# Altium project USB-Audio.PrjPcb
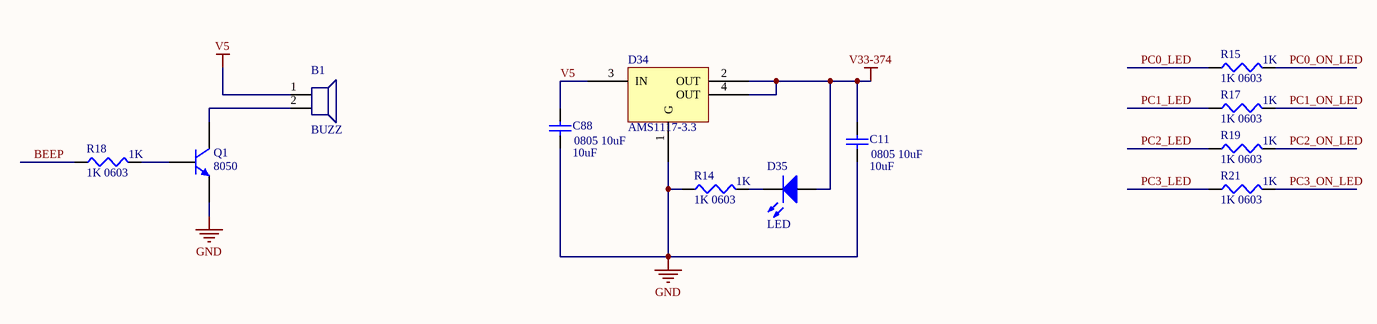
[diagram p0: CH9374.SchDoc]
8 sheets, 292 parts. Net scope: global (net labels, ports and power ports of the same name join across sheets).
Sheets:
  CH9374.SchDoc
  GL852-0.SchDoc
  GL852-1.SchDoc
  GL852-2.SchDoc
  GL852-3.SchDoc
  USB-Switch.SchDoc
  Audio.SchDoc
  CH374.SchDoc

## Sheet CH9374.SchDoc
size A4

### Parts
B1  BUZZ  [BUZZ]
C11  0805 10uF  value 10uF  [C0805]
C88  0805 10uF  value 10uF  [C0805]
D34  AMS1117-3.3  [SOT-223]
D35  LED  [LED0603]
Q1  8050  [TO-226-AA]
R14  1K 0603  value 1K  [R0603]
R15  1K 0603  value 1K  [R0603]
R17  1K 0603  value 1K  [R0603]
R18  1K 0603  value 1K  [R0603]
R19  1K 0603  value 1K  [R0603]
R21  1K 0603  value 1K  [R0603]

### Nets
GND: C11.1 C88.1 D34.1(G) Q1.3(E) R14.1
V5: B1.1(VCC) C88.2 D34.3(IN)
V33-374: C11.2 D34.2(OUT) D34.4(OUT) D35.1(A)
BEEP: R18.1
PC0_LED: R15.1
PC0_ON_LED: R15.2
PC1_LED: R17.1
PC1_ON_LED: R17.2
PC2_LED: R19.1
PC2_ON_LED: R19.2
PC3_LED: R21.1
PC3_ON_LED: R21.2
NetB1_2: B1.2(GND) Q1.1(C)
NetD35_2: D35.2(K) R14.2
NetQ1_2: Q1.2(B) R18.2

### Library data of the parts
C11 C88 = Cap Semi: Capacitor (Semiconductor SIM Model); Published: 8-Jun-2000; LatestRevisionDate: 29-May-2009; LatestRevisionNote: IPC-7351 Footprint Added.; PackageReference: C1206; Publisher: Altium Limited; PackageDescription: Chip Capacitor
Q1 = NPN: NPN Bipolar Transistor; Published: 8-Jun-2000; LatestRevisionDate: 17-Jul-2002; LatestRevisionNote: Re-released for DXP Platform.; PackageReference: TO-226-AA; Publisher: Altium Limited; PackageDescription: TO, Flat Index; 3 In-Line, Axial Leads; Body Dia. 4.8mm; Leads 0.55 x 0.51 mm (max); Code_JEDEC: TO-226-AA
R14 R15 R17-R19 R21 = Res3: Resistor; Published: 8-Jun-2000; LatestRevisionDate: 29-May-2009; LatestRevisionNote: IPC-7351 Footprint Added.; Publisher: Altium Limited; PackageDescription: Chip Resistor
  R14 R15: PackageReference: J1-0603
  R17-R19 R21: PackageReference: R0603

## Sheet GL852-0.SchDoc
size A4
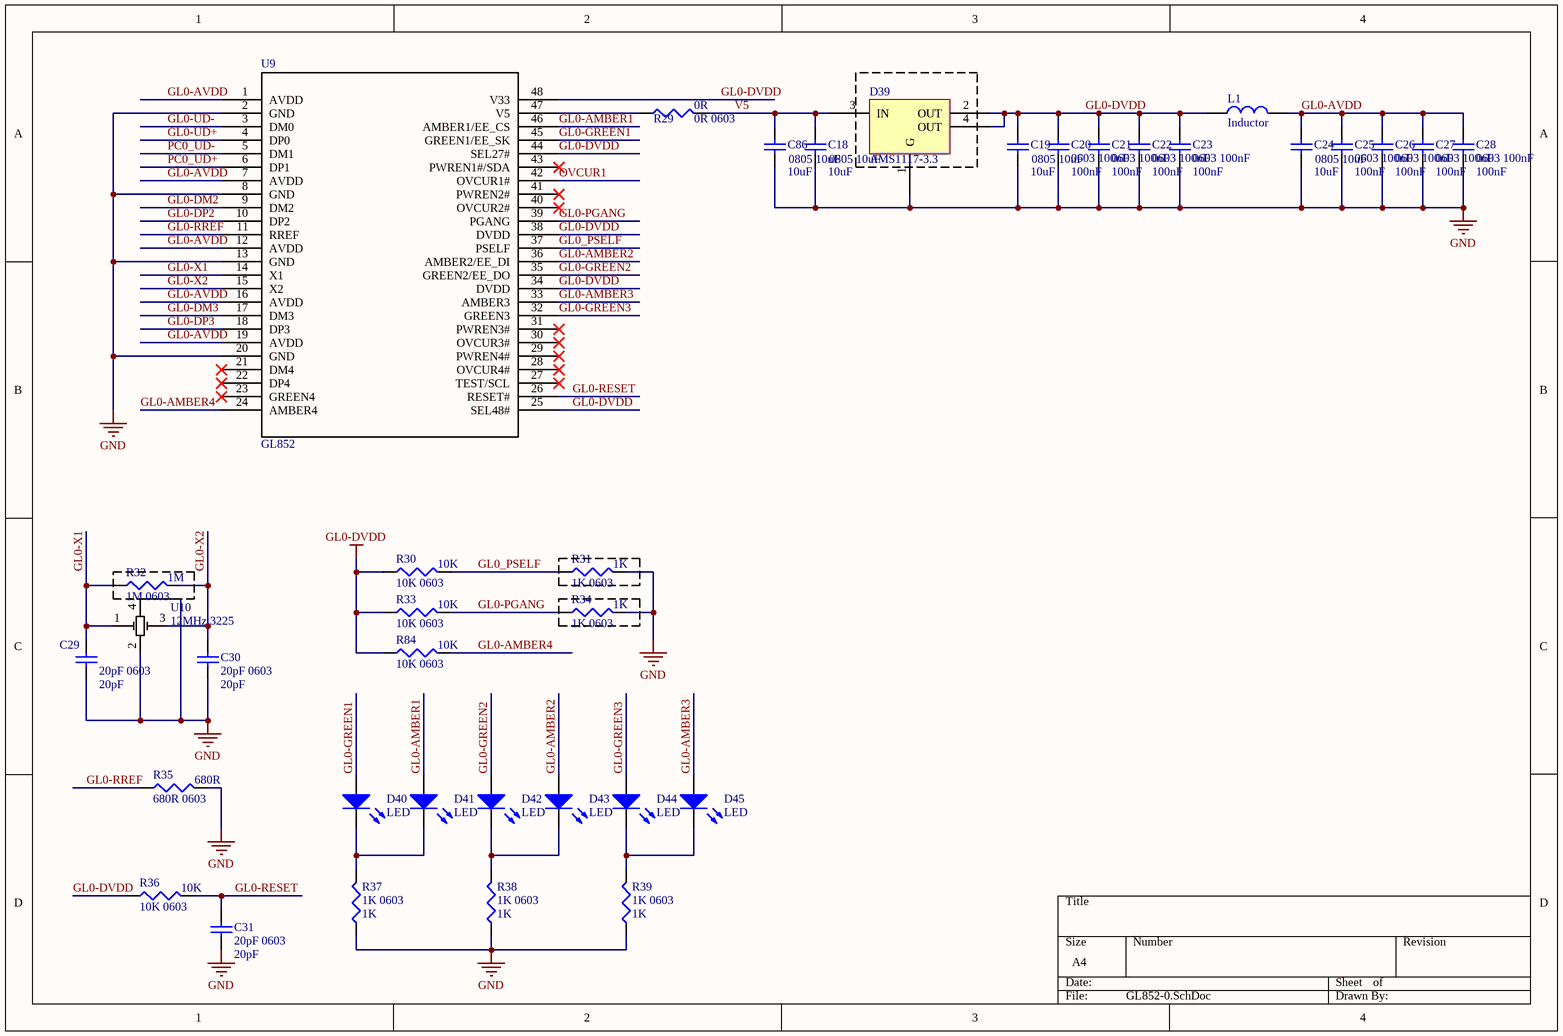
[diagram p1: GL852-0.SchDoc]

### Parts
C18  0805 10uF  value 10uF  [C0805]
C19  0805 10uF  value 10uF  [C0805]
C20  0603 100nF  value 100nF  [C0603]
C21  0603 100nF  value 100nF  [C0603]
C22  0603 100nF  value 100nF  [C0603]
C23  0603 100nF  value 100nF  [C0603]
C24  0805 10uF  value 10uF  [C0805]
C25  0603 100nF  value 100nF  [C0603]
C26  0603 100nF  value 100nF  [C0603]
C27  0603 100nF  value 100nF  [C0603]
C28  0603 100nF  value 100nF  [C0603]
C29  20pF 0603  value 20pF  [C0603]
C30  20pF 0603  value 20pF  [C0603]
C31  20pF 0603  value 20pF  [C0603]
C86  0805 10uF  value 10uF  [C0805]
D39  AMS1117-3.3  [SOT-223]
D40  LED  [LED0603]
D41  LED  [LED0603]
D42  LED  [LED0603]
D43  LED  [LED0603]
D44  LED  [LED0603]
D45  LED  [LED0603]
L1  Inductor  [L0603]
R29  0R 0603  value 0R  [R0603]
R30  10K 0603  value 10K  [R0603]
R31  1K 0603  value 1K  [R0603]
R32  1M 0603  value 1M  [R0603]
R33  10K 0603  value 10K  [R0603]
R34  1K 0603  value 1K  [R0603]
R35  680R 0603  value 680R  [R0603]
R36  10K 0603  value 10K  [R0603]
R37  1K 0603  value 1K  [R0603]
R38  1K 0603  value 1K  [R0603]
R39  1K 0603  value 1K  [R0603]
R84  10K 0603  value 10K  [R0603]
U9  GL852  [qfp48-20-0909b]
U10  12MHz 3225  [XTAL-3225]

### Nets
GL0-DVDD: C19.2 C20.2 C21.2 C22.2 C23.2 D39.2(OUT) D39.4(OUT) L1.1 R30.1 R33.1 R36.1 R84.1 U9.25(SEL48#) U9.34(DVDD) U9.38(DVDD) U9.44(SEL27#) U9.48(V33)
GND: C18.1 C19.1 C20.1 C21.1 C22.1 C23.1 C24.1 C25.1 C26.1 C27.1 C28.1 C29.1 C30.1 C31.1 C86.1 D39.1(G) R31.2 R34.2 R35.2 R37.1 R38.1 R39.1 U9.2(GND) U9.8(GND) U9.13(GND) U9.20(GND) U10.2 U10.4
V5: C18.2 C86.2 D39.3(IN) R29.2
GL0-AMBER1: D41.1(A) U9.46(AMBER1/EE_CS)
GL0-AMBER2: D43.1(A) U9.36(AMBER2/EE_DI)
GL0-AMBER3: D45.1(A) U9.33(AMBER3)
GL0-AMBER4: R84.2 U9.24(AMBER4)
GL0-AVDD: C24.2 C25.2 C26.2 C27.2 C28.2 L1.2 U9.1(AVDD) U9.7(AVDD) U9.12(AVDD) U9.16(AVDD) U9.19(AVDD)
GL0-DM2: U9.9(DM2)
GL0-DM3: U9.17(DM3)
GL0-DP2: U9.10(DP2)
GL0-DP3: U9.18(DP3)
GL0-GREEN1: D40.1(A) U9.45(GREEN1/EE_SK)
GL0-GREEN2: D42.1(A) U9.35(GREEN2/EE_DO)
GL0-GREEN3: D44.1(A) U9.32(GREEN3)
GL0-PGANG: R33.2 R34.1 U9.39(PGANG)
GL0-RESET: C31.2 R36.2 U9.26(RESET#)
GL0-RREF: R35.1 U9.11(RREF)
GL0-UD+: U9.4(DP0)
GL0-UD-: U9.3(DM0)
GL0-X1: C29.2 R32.1 U9.14(X1) U10.1
GL0-X2: C30.2 R32.2 U9.15(X2) U10.3
GL0_PSELF: R30.2 R31.1 U9.37(PSELF)
OVCUR1: U9.42(OVCUR1#)
PC0_UD+: U9.6(DP1)
PC0_UD-: U9.5(DM1)
NetD40_2: D40.2(K) D41.2(K) R37.2
NetD42_2: D42.2(K) D43.2(K) R38.2
NetD44_2: D44.2(K) D45.2(K) R39.2
NetR29_1: R29.1 U9.47(V5)

Not connected (* = marked no-connect by the designer): U9 21(DM4)* 22(DP4)* 23(GREEN4)* 27(TEST/SCL)* 28(OVCUR4#)* 29(PWREN4#)* 30(OVCUR3#)* 31(PWREN3#)* 40(OVCUR2#)* 41(PWREN2#)* 43(PWREN1#/SDA)*

### Library data of the parts
C18-C31 C86 = Cap Semi: Capacitor (Semiconductor SIM Model); Published: 8-Jun-2000; LatestRevisionDate: 29-May-2009; LatestRevisionNote: IPC-7351 Footprint Added.; PackageReference: C1206; Publisher: Altium Limited; PackageDescription: Chip Capacitor
R29-R39 R84 = Res3: Resistor; Published: 8-Jun-2000; LatestRevisionDate: 29-May-2009; LatestRevisionNote: IPC-7351 Footprint Added.; PackageReference: J1-0603; Publisher: Altium Limited; PackageDescription: Chip Resistor
U9 = GL852: Imported; Devide: GL852; RefDes: RefDes; Type: DEV; Value: Value
U10 = Component_1

## Sheet GL852-1.SchDoc
size A4
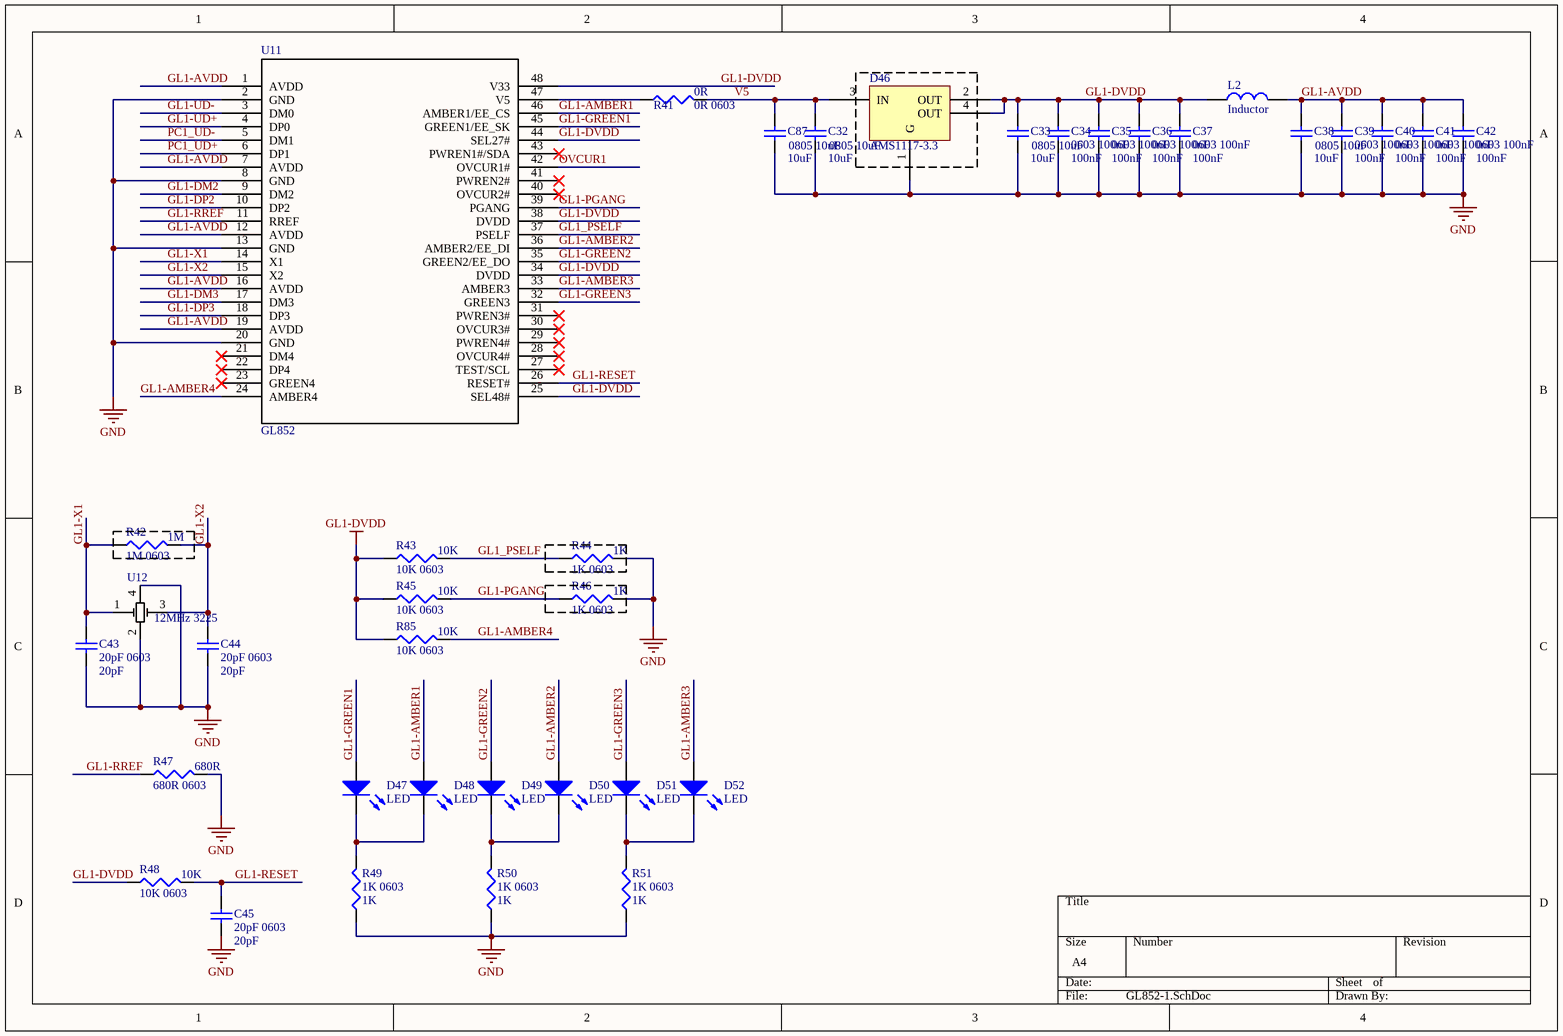
[diagram p2: GL852-1.SchDoc]

### Parts
C32  0805 10uF  value 10uF  [C0805]
C33  0805 10uF  value 10uF  [C0805]
C34  0603 100nF  value 100nF  [C0603]
C35  0603 100nF  value 100nF  [C0603]
C36  0603 100nF  value 100nF  [C0603]
C37  0603 100nF  value 100nF  [C0603]
C38  0805 10uF  value 10uF  [C0805]
C39  0603 100nF  value 100nF  [C0603]
C40  0603 100nF  value 100nF  [C0603]
C41  0603 100nF  value 100nF  [C0603]
C42  0603 100nF  value 100nF  [C0603]
C43  20pF 0603  value 20pF  [C0603]
C44  20pF 0603  value 20pF  [C0603]
C45  20pF 0603  value 20pF  [C0603]
C87  0805 10uF  value 10uF  [C0805]
D46  AMS1117-3.3  [SOT-223]
D47  LED  [LED0603]
D48  LED  [LED0603]
D49  LED  [LED0603]
D50  LED  [LED0603]
D51  LED  [LED0603]
D52  LED  [LED0603]
L2  Inductor  [L0603]
R41  0R 0603  value 0R  [R0603]
R42  1M 0603  value 1M  [R0603]
R43  10K 0603  value 10K  [R0603]
R44  1K 0603  value 1K  [R0603]
R45  10K 0603  value 10K  [R0603]
R46  1K 0603  value 1K  [R0603]
R47  680R 0603  value 680R  [R0603]
R48  10K 0603  value 10K  [R0603]
R49  1K 0603  value 1K  [R0603]
R50  1K 0603  value 1K  [R0603]
R51  1K 0603  value 1K  [R0603]
R85  10K 0603  value 10K  [R0603]
U11  GL852  [qfp48-20-0909b]
U12  12MHz 3225  [XTAL-3225]

### Nets
GL1-DVDD: C33.2 C34.2 C35.2 C36.2 C37.2 D46.2(OUT) D46.4(OUT) L2.1 R43.1 R45.1 R48.1 R85.1 U11.25(SEL48#) U11.34(DVDD) U11.38(DVDD) U11.44(SEL27#) U11.48(V33)
GND: C32.1 C33.1 C34.1 C35.1 C36.1 C37.1 C38.1 C39.1 C40.1 C41.1 C42.1 C43.1 C44.1 C45.1 C87.1 D46.1(G) R44.2 R46.2 R47.2 R49.1 R50.1 R51.1 U11.2(GND) U11.8(GND) U11.13(GND) U11.20(GND) U12.2 U12.4
V5: C32.2 C87.2 D46.3(IN) R41.2
GL1-AMBER1: D48.1(A) U11.46(AMBER1/EE_CS)
GL1-AMBER2: D50.1(A) U11.36(AMBER2/EE_DI)
GL1-AMBER3: D52.1(A) U11.33(AMBER3)
GL1-AMBER4: R85.2 U11.24(AMBER4)
GL1-AVDD: C38.2 C39.2 C40.2 C41.2 C42.2 L2.2 U11.1(AVDD) U11.7(AVDD) U11.12(AVDD) U11.16(AVDD) U11.19(AVDD)
GL1-DM2: U11.9(DM2)
GL1-DM3: U11.17(DM3)
GL1-DP2: U11.10(DP2)
GL1-DP3: U11.18(DP3)
GL1-GREEN1: D47.1(A) U11.45(GREEN1/EE_SK)
GL1-GREEN2: D49.1(A) U11.35(GREEN2/EE_DO)
GL1-GREEN3: D51.1(A) U11.32(GREEN3)
GL1-PGANG: R45.2 R46.1 U11.39(PGANG)
GL1-RESET: C45.2 R48.2 U11.26(RESET#)
GL1-RREF: R47.1 U11.11(RREF)
GL1-UD+: U11.4(DP0)
GL1-UD-: U11.3(DM0)
GL1-X1: C43.2 R42.1 U11.14(X1) U12.1
GL1-X2: C44.2 R42.2 U11.15(X2) U12.3
GL1_PSELF: R43.2 R44.1 U11.37(PSELF)
OVCUR1: U11.42(OVCUR1#)
PC1_UD+: U11.6(DP1)
PC1_UD-: U11.5(DM1)
NetD47_2: D47.2(K) D48.2(K) R49.2
NetD49_2: D49.2(K) D50.2(K) R50.2
NetD51_2: D51.2(K) D52.2(K) R51.2
NetR41_1: R41.1 U11.47(V5)

Not connected (* = marked no-connect by the designer): U11 21(DM4)* 22(DP4)* 23(GREEN4)* 27(TEST/SCL)* 28(OVCUR4#)* 29(PWREN4#)* 30(OVCUR3#)* 31(PWREN3#)* 40(OVCUR2#)* 41(PWREN2#)* 43(PWREN1#/SDA)*

### Library data of the parts
C32-C45 C87 = Cap Semi: Capacitor (Semiconductor SIM Model); Published: 8-Jun-2000; LatestRevisionDate: 29-May-2009; LatestRevisionNote: IPC-7351 Footprint Added.; PackageReference: C1206; Publisher: Altium Limited; PackageDescription: Chip Capacitor
R41-R51 R85 = Res3: Resistor; Published: 8-Jun-2000; LatestRevisionDate: 29-May-2009; LatestRevisionNote: IPC-7351 Footprint Added.; PackageReference: J1-0603; Publisher: Altium Limited; PackageDescription: Chip Resistor
U11 = GL852: Imported; Devide: GL852; RefDes: RefDes; Type: DEV; Value: Value
U12 = Component_1

## Sheet GL852-2.SchDoc
size A4
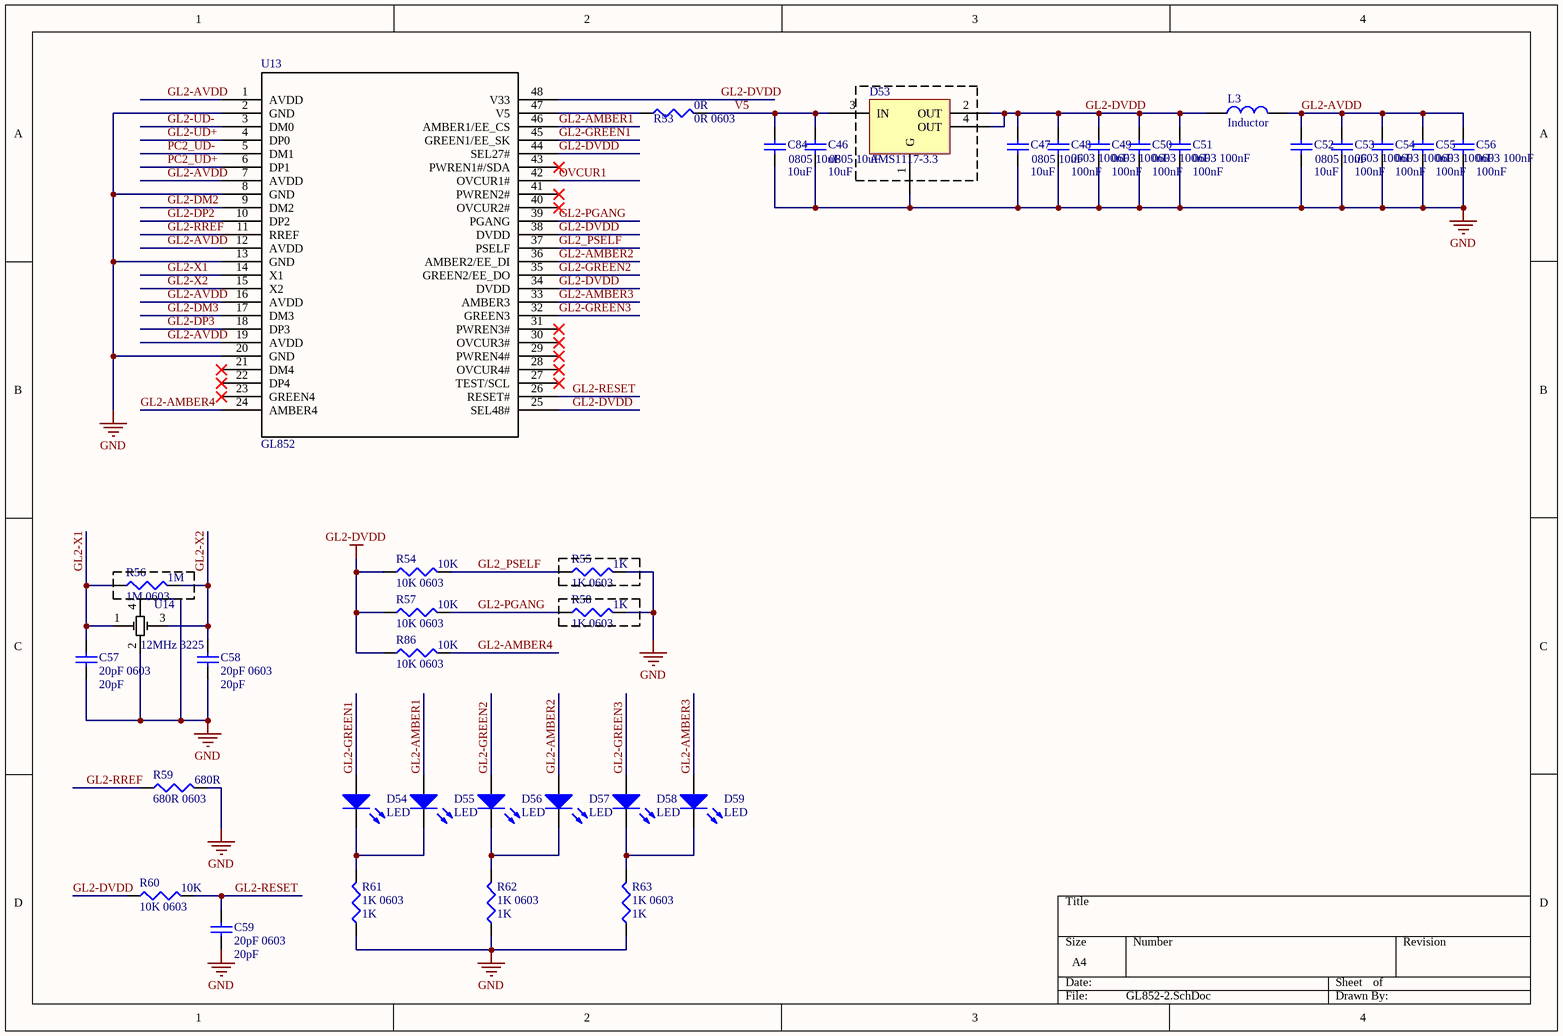
[diagram p3: GL852-2.SchDoc]

### Parts
C46  0805 10uF  value 10uF  [C0805]
C47  0805 10uF  value 10uF  [C0805]
C48  0603 100nF  value 100nF  [C0603]
C49  0603 100nF  value 100nF  [C0603]
C50  0603 100nF  value 100nF  [C0603]
C51  0603 100nF  value 100nF  [C0603]
C52  0805 10uF  value 10uF  [C0805]
C53  0603 100nF  value 100nF  [C0603]
C54  0603 100nF  value 100nF  [C0603]
C55  0603 100nF  value 100nF  [C0603]
C56  0603 100nF  value 100nF  [C0603]
C57  20pF 0603  value 20pF  [C0603]
C58  20pF 0603  value 20pF  [C0603]
C59  20pF 0603  value 20pF  [C0603]
C84  0805 10uF  value 10uF  [C0805]
D53  AMS1117-3.3  [SOT-223]
D54  LED  [LED0603]
D55  LED  [LED0603]
D56  LED  [LED0603]
D57  LED  [LED0603]
D58  LED  [LED0603]
D59  LED  [LED0603]
L3  Inductor  [L0603]
R53  0R 0603  value 0R  [R0603]
R54  10K 0603  value 10K  [R0603]
R55  1K 0603  value 1K  [R0603]
R56  1M 0603  value 1M  [R0603]
R57  10K 0603  value 10K  [R0603]
R58  1K 0603  value 1K  [R0603]
R59  680R 0603  value 680R  [R0603]
R60  10K 0603  value 10K  [R0603]
R61  1K 0603  value 1K  [R0603]
R62  1K 0603  value 1K  [R0603]
R63  1K 0603  value 1K  [R0603]
R86  10K 0603  value 10K  [R0603]
U13  GL852  [qfp48-20-0909b]
U14  12MHz 3225  [XTAL-3225]

### Nets
GL2-DVDD: C47.2 C48.2 C49.2 C50.2 C51.2 D53.2(OUT) D53.4(OUT) L3.1 R54.1 R57.1 R60.1 R86.1 U13.25(SEL48#) U13.34(DVDD) U13.38(DVDD) U13.44(SEL27#) U13.48(V33)
GND: C46.1 C47.1 C48.1 C49.1 C50.1 C51.1 C52.1 C53.1 C54.1 C55.1 C56.1 C57.1 C58.1 C59.1 C84.1 D53.1(G) R55.2 R58.2 R59.2 R61.1 R62.1 R63.1 U13.2(GND) U13.8(GND) U13.13(GND) U13.20(GND) U14.2 U14.4
V5: C46.2 C84.2 D53.3(IN) R53.2
GL2-AMBER1: D55.1(A) U13.46(AMBER1/EE_CS)
GL2-AMBER2: D57.1(A) U13.36(AMBER2/EE_DI)
GL2-AMBER3: D59.1(A) U13.33(AMBER3)
GL2-AMBER4: R86.2 U13.24(AMBER4)
GL2-AVDD: C52.2 C53.2 C54.2 C55.2 C56.2 L3.2 U13.1(AVDD) U13.7(AVDD) U13.12(AVDD) U13.16(AVDD) U13.19(AVDD)
GL2-DM2: U13.9(DM2)
GL2-DM3: U13.17(DM3)
GL2-DP2: U13.10(DP2)
GL2-DP3: U13.18(DP3)
GL2-GREEN1: D54.1(A) U13.45(GREEN1/EE_SK)
GL2-GREEN2: D56.1(A) U13.35(GREEN2/EE_DO)
GL2-GREEN3: D58.1(A) U13.32(GREEN3)
GL2-PGANG: R57.2 R58.1 U13.39(PGANG)
GL2-RESET: C59.2 R60.2 U13.26(RESET#)
GL2-RREF: R59.1 U13.11(RREF)
GL2-UD+: U13.4(DP0)
GL2-UD-: U13.3(DM0)
GL2-X1: C57.2 R56.1 U13.14(X1) U14.1
GL2-X2: C58.2 R56.2 U13.15(X2) U14.3
GL2_PSELF: R54.2 R55.1 U13.37(PSELF)
OVCUR1: U13.42(OVCUR1#)
PC2_UD+: U13.6(DP1)
PC2_UD-: U13.5(DM1)
NetD54_2: D54.2(K) D55.2(K) R61.2
NetD56_2: D56.2(K) D57.2(K) R62.2
NetD58_2: D58.2(K) D59.2(K) R63.2
NetR53_1: R53.1 U13.47(V5)

Not connected (* = marked no-connect by the designer): U13 21(DM4)* 22(DP4)* 23(GREEN4)* 27(TEST/SCL)* 28(OVCUR4#)* 29(PWREN4#)* 30(OVCUR3#)* 31(PWREN3#)* 40(OVCUR2#)* 41(PWREN2#)* 43(PWREN1#/SDA)*

### Library data of the parts
C46-C59 C84 = Cap Semi: Capacitor (Semiconductor SIM Model); Published: 8-Jun-2000; LatestRevisionDate: 29-May-2009; LatestRevisionNote: IPC-7351 Footprint Added.; PackageReference: C1206; Publisher: Altium Limited; PackageDescription: Chip Capacitor
R53-R63 R86 = Res3: Resistor; Published: 8-Jun-2000; LatestRevisionDate: 29-May-2009; LatestRevisionNote: IPC-7351 Footprint Added.; PackageReference: J1-0603; Publisher: Altium Limited; PackageDescription: Chip Resistor
U13 = GL852: Imported; Devide: GL852; RefDes: RefDes; Type: DEV; Value: Value
U14 = Component_1

## Sheet GL852-3.SchDoc
size A4
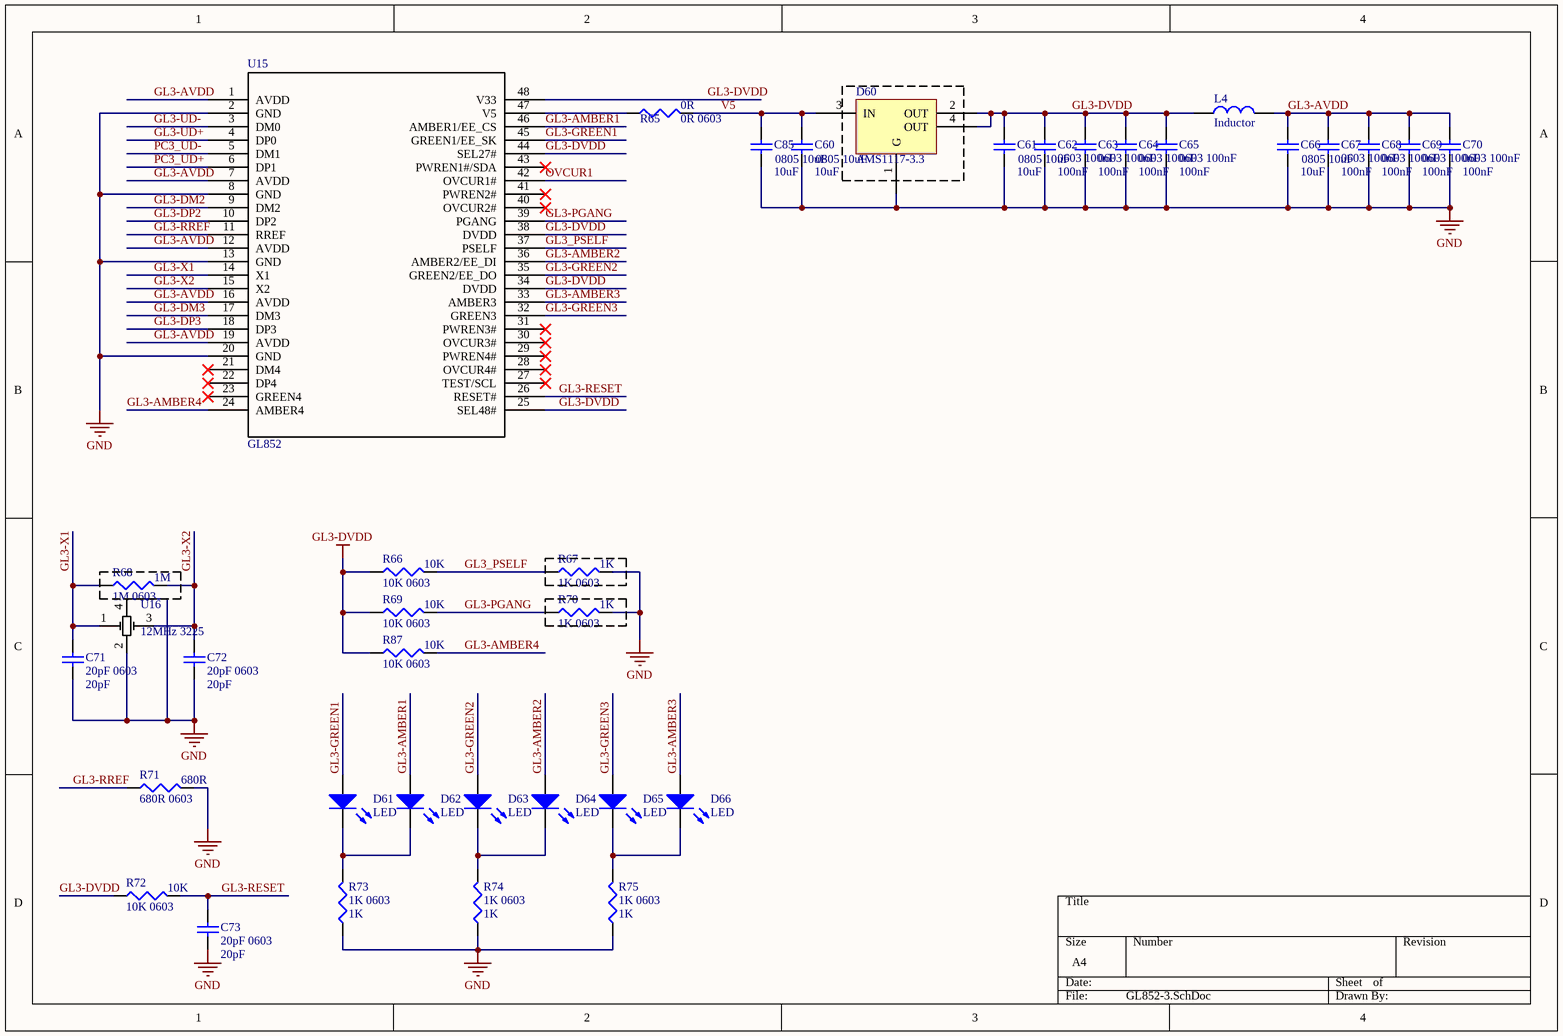
[diagram p4: GL852-3.SchDoc]

### Parts
C60  0805 10uF  value 10uF  [C0805]
C61  0805 10uF  value 10uF  [C0805]
C62  0603 100nF  value 100nF  [C0603]
C63  0603 100nF  value 100nF  [C0603]
C64  0603 100nF  value 100nF  [C0603]
C65  0603 100nF  value 100nF  [C0603]
C66  0805 10uF  value 10uF  [C0805]
C67  0603 100nF  value 100nF  [C0603]
C68  0603 100nF  value 100nF  [C0603]
C69  0603 100nF  value 100nF  [C0603]
C70  0603 100nF  value 100nF  [C0603]
C71  20pF 0603  value 20pF  [C0603]
C72  20pF 0603  value 20pF  [C0603]
C73  20pF 0603  value 20pF  [C0603]
C85  0805 10uF  value 10uF  [C0805]
D60  AMS1117-3.3  [SOT-223]
D61  LED  [LED0603]
D62  LED  [LED0603]
D63  LED  [LED0603]
D64  LED  [LED0603]
D65  LED  [LED0603]
D66  LED  [LED0603]
L4  Inductor  [L0603]
R65  0R 0603  value 0R  [R0603]
R66  10K 0603  value 10K  [R0603]
R67  1K 0603  value 1K  [R0603]
R68  1M 0603  value 1M  [R0603]
R69  10K 0603  value 10K  [R0603]
R70  1K 0603  value 1K  [R0603]
R71  680R 0603  value 680R  [R0603]
R72  10K 0603  value 10K  [R0603]
R73  1K 0603  value 1K  [R0603]
R74  1K 0603  value 1K  [R0603]
R75  1K 0603  value 1K  [R0603]
R87  10K 0603  value 10K  [R0603]
U15  GL852  [qfp48-20-0909b]
U16  12MHz 3225  [XTAL-3225]

### Nets
GL3-DVDD: C61.2 C62.2 C63.2 C64.2 C65.2 D60.2(OUT) D60.4(OUT) L4.1 R66.1 R69.1 R72.1 R87.1 U15.25(SEL48#) U15.34(DVDD) U15.38(DVDD) U15.44(SEL27#) U15.48(V33)
GND: C60.1 C61.1 C62.1 C63.1 C64.1 C65.1 C66.1 C67.1 C68.1 C69.1 C70.1 C71.1 C72.1 C73.1 C85.1 D60.1(G) R67.2 R70.2 R71.2 R73.1 R74.1 R75.1 U15.2(GND) U15.8(GND) U15.13(GND) U15.20(GND) U16.2 U16.4
V5: C60.2 C85.2 D60.3(IN) R65.2
GL3-AMBER1: D62.1(A) U15.46(AMBER1/EE_CS)
GL3-AMBER2: D64.1(A) U15.36(AMBER2/EE_DI)
GL3-AMBER3: D66.1(A) U15.33(AMBER3)
GL3-AMBER4: R87.2 U15.24(AMBER4)
GL3-AVDD: C66.2 C67.2 C68.2 C69.2 C70.2 L4.2 U15.1(AVDD) U15.7(AVDD) U15.12(AVDD) U15.16(AVDD) U15.19(AVDD)
GL3-DM2: U15.9(DM2)
GL3-DM3: U15.17(DM3)
GL3-DP2: U15.10(DP2)
GL3-DP3: U15.18(DP3)
GL3-GREEN1: D61.1(A) U15.45(GREEN1/EE_SK)
GL3-GREEN2: D63.1(A) U15.35(GREEN2/EE_DO)
GL3-GREEN3: D65.1(A) U15.32(GREEN3)
GL3-PGANG: R69.2 R70.1 U15.39(PGANG)
GL3-RESET: C73.2 R72.2 U15.26(RESET#)
GL3-RREF: R71.1 U15.11(RREF)
GL3-UD+: U15.4(DP0)
GL3-UD-: U15.3(DM0)
GL3-X1: C71.2 R68.1 U15.14(X1) U16.1
GL3-X2: C72.2 R68.2 U15.15(X2) U16.3
GL3_PSELF: R66.2 R67.1 U15.37(PSELF)
OVCUR1: U15.42(OVCUR1#)
PC3_UD+: U15.6(DP1)
PC3_UD-: U15.5(DM1)
NetD61_2: D61.2(K) D62.2(K) R73.2
NetD63_2: D63.2(K) D64.2(K) R74.2
NetD65_2: D65.2(K) D66.2(K) R75.2
NetR65_1: R65.1 U15.47(V5)

Not connected (* = marked no-connect by the designer): U15 21(DM4)* 22(DP4)* 23(GREEN4)* 27(TEST/SCL)* 28(OVCUR4#)* 29(PWREN4#)* 30(OVCUR3#)* 31(PWREN3#)* 40(OVCUR2#)* 41(PWREN2#)* 43(PWREN1#/SDA)*

### Library data of the parts
C60-C73 C85 = Cap Semi: Capacitor (Semiconductor SIM Model); Published: 8-Jun-2000; LatestRevisionDate: 29-May-2009; LatestRevisionNote: IPC-7351 Footprint Added.; PackageReference: C1206; Publisher: Altium Limited; PackageDescription: Chip Capacitor
R65-R75 R87 = Res3: Resistor; Published: 8-Jun-2000; LatestRevisionDate: 29-May-2009; LatestRevisionNote: IPC-7351 Footprint Added.; PackageReference: J1-0603; Publisher: Altium Limited; PackageDescription: Chip Resistor
U15 = GL852: Imported; Devide: GL852; RefDes: RefDes; Type: DEV; Value: Value
U16 = Component_1

## Sheet USB-Switch.SchDoc
size A4
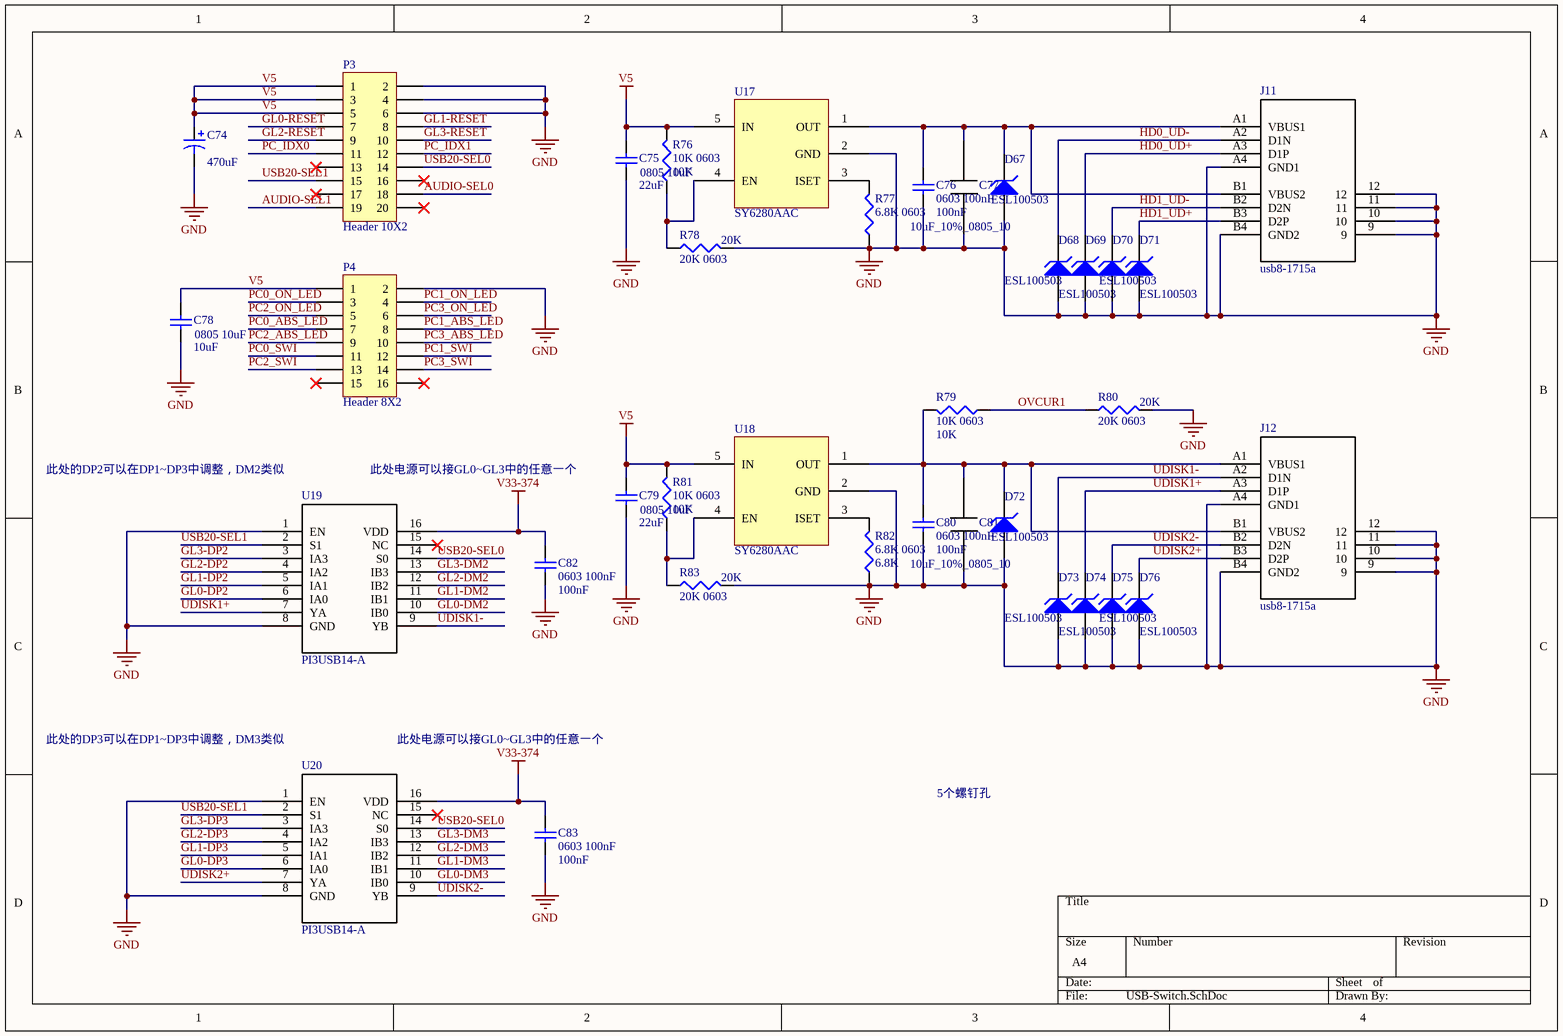
[diagram p5: USB-Switch.SchDoc]

### Parts
C74  470uF  [RB7_6-15]
C75  0805 10uF  value 22uF  [C0805]
C76  0603 100nF  value 100nF  [C0603]
C77  10uF_10%_0805_10  [C0805]
C78  0805 10uF  value 10uF  [C0805]
C79  0805 10uF  value 22uF  [C0805]
C80  0603 100nF  value 100nF  [C0603]
C81  10uF_10%_0805_10  [C0805]
C82  0603 100nF  value 100nF  [C0603]
C83  0603 100nF  value 100nF  [C0603]
D67  ESL100503  [C0402]
D68  ESL100503  [C0402]
D69  ESL100503  [C0402]
D70  ESL100503  [C0402]
D71  ESL100503  [C0402]
D72  ESL100503  [C0402]
D73  ESL100503  [C0402]
D74  ESL100503  [C0402]
D75  ESL100503  [C0402]
D76  ESL100503  [C0402]
J11  usb8-1715a  [usb8-1715a]
J12  usb8-1715a  [usb8-1715a]
P3  Header 10X2  [HDR2X10]
P4  Header 8X2  [HDR2X8]
R76  10K 0603  value 10K  [R0603]
R77  6.8K 0603  [R0603]
R78  20K 0603  value 20K  [R0603]
R79  10K 0603  value 10K  [R0603]
R80  20K 0603  value 20K  [R0603]
R81  10K 0603  value 10K  [R0603]
R82  6.8K 0603  value 6.8K  [R0603]
R83  20K 0603  value 20K  [R0603]
U17  SY6280AAC  [SOT23-5]
U18  SY6280AAC  [SOT23-5]
U19  PI3USB14-A  [sop16-26-064a]
U20  PI3USB14-A  [sop16-26-064a]

### Nets
GND: C74.2 C75.1 C76.1 C77.1 C78.1 C79.1 C80.1 C81.1 C82.1 C83.1 D67.1(A) D68.1(A) D69.1(A) D70.1(A) D71.1(A) D72.1(A) D73.1(A) D74.1(A) D75.1(A) D76.1(A) J11.9 J11.10 J11.11 J11.12 J11.A4(GND1) J11.B4(GND2) J12.9 J12.10 J12.11 J12.12 J12.A4(GND1) J12.B4(GND2) P3.2 P3.4 P3.6 P4.2 R77.1 R78.2 R80.2 R82.1 R83.2 U17.2(GND) U18.2(GND) U19.1(EN) U19.8(GND) U20.1(EN) U20.8(GND)
V5: C74.1 C75.2 C78.2 C79.2 P3.1 P3.3 P3.5 P4.1 R76.2 R81.2 U17.5(IN) U18.5(IN)
V33-374: C82.2 C83.2 U19.16(VDD) U20.16(VDD)
AUDIO-SEL0: P3.18
AUDIO-SEL1: P3.19
GL0-DM2: U19.10(IB0)
GL0-DM3: U20.10(IB0)
GL0-DP2: U19.6(IA0)
GL0-DP3: U20.6(IA0)
GL0-RESET: P3.7
GL1-DM2: U19.11(IB1)
GL1-DM3: U20.11(IB1)
GL1-DP2: U19.5(IA1)
GL1-DP3: U20.5(IA1)
GL1-RESET: P3.8
GL2-DM2: U19.12(IB2)
GL2-DM3: U20.12(IB2)
GL2-DP2: U19.4(IA2)
GL2-DP3: U20.4(IA2)
GL2-RESET: P3.9
GL3-DM2: U19.13(IB3)
GL3-DM3: U20.13(IB3)
GL3-DP2: U19.3(IA3)
GL3-DP3: U20.3(IA3)
GL3-RESET: P3.10
HD0_UD+: D69.2(K) J11.A3(D1P)
HD0_UD-: D68.2(K) J11.A2(D1N)
HD1_UD+: D71.2(K) J11.B3(D2P)
HD1_UD-: D70.2(K) J11.B2(D2N)
OVCUR1: R79.1 R80.1
PC0_ABS_LED: P4.7
PC0_ON_LED: P4.3
PC0_SWI: P4.11
PC1_ABS_LED: P4.8
PC1_ON_LED: P4.4
PC1_SWI: P4.12
PC2_ABS_LED: P4.9
PC2_ON_LED: P4.5
PC2_SWI: P4.13
PC3_ABS_LED: P4.10
PC3_ON_LED: P4.6
PC3_SWI: P4.14
PC_IDX0: P3.11
PC_IDX1: P3.12
UDISK1+: D74.2(K) J12.A3(D1P) U19.7(YA)
UDISK1-: D73.2(K) J12.A2(D1N) U19.9(YB)
UDISK2+: D76.2(K) J12.B3(D2P) U20.7(YA)
UDISK2-: D75.2(K) J12.B2(D2N) U20.9(YB)
USB20-SEL0: P3.14 U19.14(S0) U20.14(S0)
USB20-SEL1: P3.15 U19.2(S1) U20.2(S1)
NetC76_2: C76.2 C77.2 D67.2(K) J11.A1(VBUS1) J11.B1(VBUS2) U17.1(OUT)
NetC80_2: C80.2 C81.2 D72.2(K) J12.A1(VBUS1) J12.B1(VBUS2) R79.2 U18.1(OUT)
NetR76_1: R76.1 R78.1 U17.4(EN)
NetR77_2: R77.2 U17.3(ISET)
NetR81_1: R81.1 R83.1 U18.4(EN)
NetR82_2: R82.2 U18.3(ISET)

Not connected (* = marked no-connect by the designer): P3 13* 16* 17* 20*; P4 15* 16*; U19 15(NC)*; U20 15(NC)*

### Notes on the sheet
- 此处的DP2可以在DP1~DP3中调整，DM2类似
- 此处电源可以接GL0~GL3中的任意一个
- 此处的DP3可以在DP1~DP3中调整，DM3类似
- 5个螺钉孔

### Library data of the parts
C74 = Cap Pol1: Polarized Capacitor (Radial); Published: 8-Jun-2000; LatestRevisionDate: 17-Jul-2002; LatestRevisionNote: Re-released for DXP Platform.; PackageReference: RB7.6-15; Publisher: Altium Limited; PackageDescription: Polarized Capacitor (Radial); 2 Leads; Value: 470uF
C75 C76 C78-C80 C82 C83 = Cap Semi: Capacitor (Semiconductor SIM Model); Published: 8-Jun-2000; LatestRevisionDate: 29-May-2009; LatestRevisionNote: IPC-7351 Footprint Added.; PackageReference: C1206; Publisher: Altium Limited; PackageDescription: Chip Capacitor
C77 C81 = 10uF_10%_0805_10: Imported; Component: 10uF_10%_0805_10V_CA; Device: 0805ZC106KAT2A; Designer: Chiphome; CHcode: CAPC1850476; Type: DEV; Value: Value; Footprint: sc0805a; RefDes: RefDes
D67-D76 = D Zener: Published: 8-Jun-2000; LatestRevisionDate: 17-Jul-2002; LatestRevisionNote: Re-released for DXP Platform.; PackageReference: DIODE-0.7; Publisher: Altium Limited; PackageDescription: Diode, Thru-Hole; 2 Leads; 0.7 in Pin Spacing
J11 J12 = usb8-1715a: Imported; RefDes: RefDes; Type: DEV; Value: Value
P3 = Header 10X2: Header, 10-Pin, Dual row; LatestRevisionDate: 17-Jul-2002; LatestRevisionNote: Re-released for DXP Platform.; Publisher: Altium Limited
P4 = Header 8X2: Header, 8-Pin, Dual row; LatestRevisionDate: 17-Jul-2002; LatestRevisionNote: Re-released for DXP Platform.; Publisher: Altium Limited
R76-R83 = Res3: Resistor; Published: 8-Jun-2000; LatestRevisionDate: 29-May-2009; LatestRevisionNote: IPC-7351 Footprint Added.; PackageReference: J1-0603; Publisher: Altium Limited; PackageDescription: Chip Resistor
  R77: Value: 6.8K
U17 U18 = Component_1
U19 U20 = PI3USB14-A: Imported; Designer: Chiphome; Device: PI3USB14-A; RefDes: RefDes; Type: DEV; Value: Value

## Sheet Audio.SchDoc
size A4
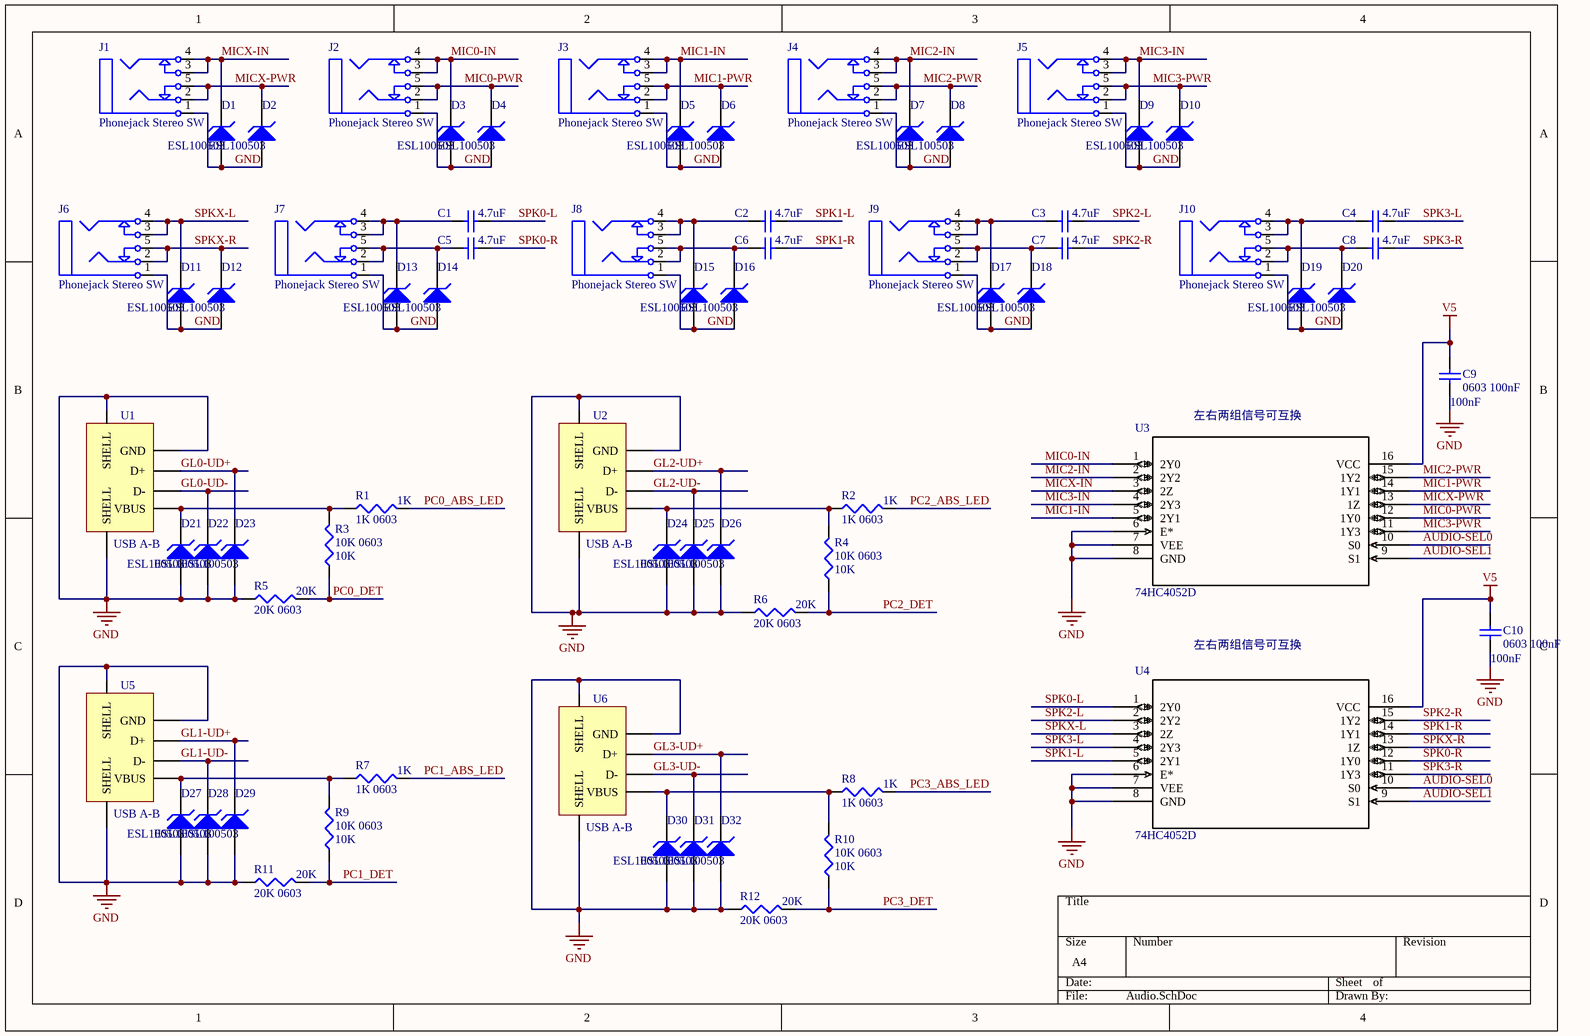
[diagram p6: Audio.SchDoc]

### Parts
C1  value 4.7uF  [C0603]  (hidden comment: 0603 4.7uF)
C2  value 4.7uF  [C0603]  (hidden comment: 0603 4.7uF)
C3  value 4.7uF  [C0603]  (hidden comment: 0603 4.7uF)
C4  value 4.7uF  [C0603]  (hidden comment: 0603 4.7uF)
C5  value 4.7uF  [C0603]  (hidden comment: 0603 4.7uF)
C6  value 4.7uF  [C0603]  (hidden comment: 0603 4.7uF)
C7  value 4.7uF  [C0603]  (hidden comment: 0603 4.7uF)
C8  value 4.7uF  [C0603]  (hidden comment: 0603 4.7uF)
C9  0603 100nF  value 100nF  [C0603]
C10  0603 100nF  value 100nF  [C0603]
D1  ESL100503  [C0402]
D2  ESL100503  [C0402]
D3  ESL100503  [C0402]
D4  ESL100503  [C0402]
D5  ESL100503  [C0402]
D6  ESL100503  [C0402]
D7  ESL100503  [C0402]
D8  ESL100503  [C0402]
D9  ESL100503  [C0402]
D10  ESL100503  [C0402]
D11  ESL100503  [C0402]
D12  ESL100503  [C0402]
D13  ESL100503  [C0402]
D14  ESL100503  [C0402]
D15  ESL100503  [C0402]
D16  ESL100503  [C0402]
D17  ESL100503  [C0402]
D18  ESL100503  [C0402]
D19  ESL100503  [C0402]
D20  ESL100503  [C0402]
D21  ESL100503  [C0402]
D22  ESL100503  [C0402]
D23  ESL100503  [C0402]
D24  ESL100503  [C0402]
D25  ESL100503  [C0402]
D26  ESL100503  [C0402]
D27  ESL100503  [C0402]
D28  ESL100503  [C0402]
D29  ESL100503  [C0402]
D30  ESL100503  [C0402]
D31  ESL100503  [C0402]
D32  ESL100503  [C0402]
J1  Phonejack Stereo SW  [ST-3150-5N]
J2  Phonejack Stereo SW  [ST-3150-5N]
J3  Phonejack Stereo SW  [ST-3150-5N]
J4  Phonejack Stereo SW  [ST-3150-5N]
J5  Phonejack Stereo SW  [ST-3150-5N]
J6  Phonejack Stereo SW  [ST-3150-5N]
J7  Phonejack Stereo SW  [ST-3150-5N]
J8  Phonejack Stereo SW  [ST-3150-5N]
J9  Phonejack Stereo SW  [ST-3150-5N]
J10  Phonejack Stereo SW  [ST-3150-5N]
R1  1K 0603  value 1K  [R0603]
R2  1K 0603  value 1K  [R0603]
R3  10K 0603  value 10K  [R0603]
R4  10K 0603  value 10K  [R0603]
R5  20K 0603  value 20K  [R0603]
R6  20K 0603  value 20K  [R0603]
R7  1K 0603  value 1K  [R0603]
R8  1K 0603  value 1K  [R0603]
R9  10K 0603  value 10K  [R0603]
R10  10K 0603  value 10K  [R0603]
R11  20K 0603  value 20K  [R0603]
R12  20K 0603  value 20K  [R0603]
U1  USB A-B  [USB-A]
U2  USB A-B  [USB-A]
U3  74HC4052D  [SOT109-1]
U4  74HC4052D  [SOT109-1]
U5  USB A-B  [USB-A]
U6  USB A-B  [USB-A]

### Nets
GND: C9.1 C10.1 D1.1(A) D2.1(A) D3.1(A) D4.1(A) D5.1(A) D6.1(A) D7.1(A) D8.1(A) D9.1(A) D10.1(A) D11.1(A) D12.1(A) D13.1(A) D14.1(A) D15.1(A) D16.1(A) D17.1(A) D18.1(A) D19.1(A) D20.1(A) D21.1(A) D22.1(A) D23.1(A) D24.1(A) D25.1(A) D26.1(A) D27.1(A) D28.1(A) D29.1(A) D30.1(A) D31.1(A) D32.1(A) J1.1 J2.1 J3.1 J4.1 J5.1 J6.1 J7.1 J8.1 J9.1 J10.1 R5.1 R6.1 R11.1 R12.1 U1.4(GND) U1.5(SHELL) U1.6(SHELL) U2.4(GND) U2.5(SHELL) U2.6(SHELL) U3.6(E*) U3.7(VEE) U3.8(GND) U4.6(E*) U4.7(VEE) U4.8(GND) U5.4(GND) U5.5(SHELL) U5.6(SHELL) U6.4(GND) U6.5(SHELL) U6.6(SHELL)
V5: C9.2 C10.2 U3.16(VCC) U4.16(VCC)
AUDIO-SEL0: U3.10(S0) U4.10(S0)
AUDIO-SEL1: U3.9(S1) U4.9(S1)
GL0-UD+: D23.2(K) U1.3(D+)
GL0-UD-: D22.2(K) U1.2(D-)
GL1-UD+: D29.2(K) U5.3(D+)
GL1-UD-: D28.2(K) U5.2(D-)
GL2-UD+: D26.2(K) U2.3(D+)
GL2-UD-: D25.2(K) U2.2(D-)
GL3-UD+: D32.2(K) U6.3(D+)
GL3-UD-: D31.2(K) U6.2(D-)
MIC0-IN: D3.2(K) J2.3 J2.4 U3.1(2Y0)
MIC0-PWR: D4.2(K) J2.2 J2.5 U3.12(1Y0)
MIC1-IN: D5.2(K) J3.3 J3.4 U3.5(2Y1)
MIC1-PWR: D6.2(K) J3.2 J3.5 U3.14(1Y1)
MIC2-IN: D7.2(K) J4.3 J4.4 U3.2(2Y2)
MIC2-PWR: D8.2(K) J4.2 J4.5 U3.15(1Y2)
MIC3-IN: D9.2(K) J5.3 J5.4 U3.4(2Y3)
MIC3-PWR: D10.2(K) J5.2 J5.5 U3.11(1Y3)
MICX-IN: D1.2(K) J1.3 J1.4 U3.3(2Z)
MICX-PWR: D2.2(K) J1.2 J1.5 U3.13(1Z)
PC0_ABS_LED: R1.2
PC0_DET: R3.1 R5.2
PC1_ABS_LED: R7.2
PC1_DET: R9.1 R11.2
PC2_ABS_LED: R2.2
PC2_DET: R4.1 R6.2
PC3_ABS_LED: R8.2
PC3_DET: R10.1 R12.2
SPK0-L: C1.1 U4.1(2Y0)
SPK0-R: C5.1 U4.12(1Y0)
SPK1-L: C2.1 U4.5(2Y1)
SPK1-R: C6.1 U4.14(1Y1)
SPK2-L: C3.1 U4.2(2Y2)
SPK2-R: C7.1 U4.15(1Y2)
SPK3-L: C4.1 U4.4(2Y3)
SPK3-R: C8.1 U4.11(1Y3)
SPKX-L: D11.2(K) J6.3 J6.4 U4.3(2Z)
SPKX-R: D12.2(K) J6.2 J6.5 U4.13(1Z)
NetC1_2: C1.2 D13.2(K) J7.3 J7.4
NetC2_2: C2.2 D15.2(K) J8.3 J8.4
NetC3_2: C3.2 D17.2(K) J9.3 J9.4
NetC4_2: C4.2 D19.2(K) J10.3 J10.4
NetC5_2: C5.2 D14.2(K) J7.2 J7.5
NetC6_2: C6.2 D16.2(K) J8.2 J8.5
NetC7_2: C7.2 D18.2(K) J9.2 J9.5
NetC8_2: C8.2 D20.2(K) J10.2 J10.5
NetD21_2: D21.2(K) R1.1 R3.2 U1.1(VBUS)
NetD24_2: D24.2(K) R2.1 R4.2 U2.1(VBUS)
NetD27_2: D27.2(K) R7.1 R9.2 U5.1(VBUS)
NetD30_2: D30.2(K) R8.1 R10.2 U6.1(VBUS)

### Notes on the sheet
- (near U3) 左右两组信号可互换
- 左右两组信号可互换

### Library data of the parts
C1-C10 = Cap Semi: Capacitor (Semiconductor SIM Model); Published: 8-Jun-2000; LatestRevisionDate: 29-May-2009; LatestRevisionNote: IPC-7351 Footprint Added.; PackageReference: C1206; Publisher: Altium Limited; PackageDescription: Chip Capacitor
D1-D32 = D Zener: Published: 8-Jun-2000; LatestRevisionDate: 17-Jul-2002; LatestRevisionNote: Re-released for DXP Platform.; Publisher: Altium Limited; PackageDescription: Diode, Thru-Hole; 2 Leads; 0.7 in Pin Spacing
  D1-D25 D27-D32: PackageReference: DIODE-0.7
  D26: PackageReference: 0402
J1-J10 = Phonejack Stereo SW: 3-Conductor Jack with 2 break contacts (normals) and 2 auxiliary make contacts; Published: 5-Jan-2004; LatestRevisionDate: 17-Dec-2003; LatestRevisionNote: PCB Footprint replaced.; DatasheetDocument: 07-Mar-2000; Publisher: Altium Limited; ComponentLink1Description: Manufacturer Link; ComponentLink1URL: http://domino.kycon.com/internet/Products.html
R1-R12 = Res3: Resistor; Published: 8-Jun-2000; LatestRevisionDate: 29-May-2009; LatestRevisionNote: IPC-7351 Footprint Added.; PackageReference: J1-0603; Publisher: Altium Limited; PackageDescription: Chip Resistor
U3 U4 = 74HC4052D: Imported; Vendor: NXP; Built_By: EMA_UL_Team; C: Copyright (C) 2015 Accelerated Designs. All rights reserved; Manufacturer_Part_Number: 74hc4052d; RefDes: RefDes; Type: Type; Value: Value

## Sheet CH374.SchDoc
size A4
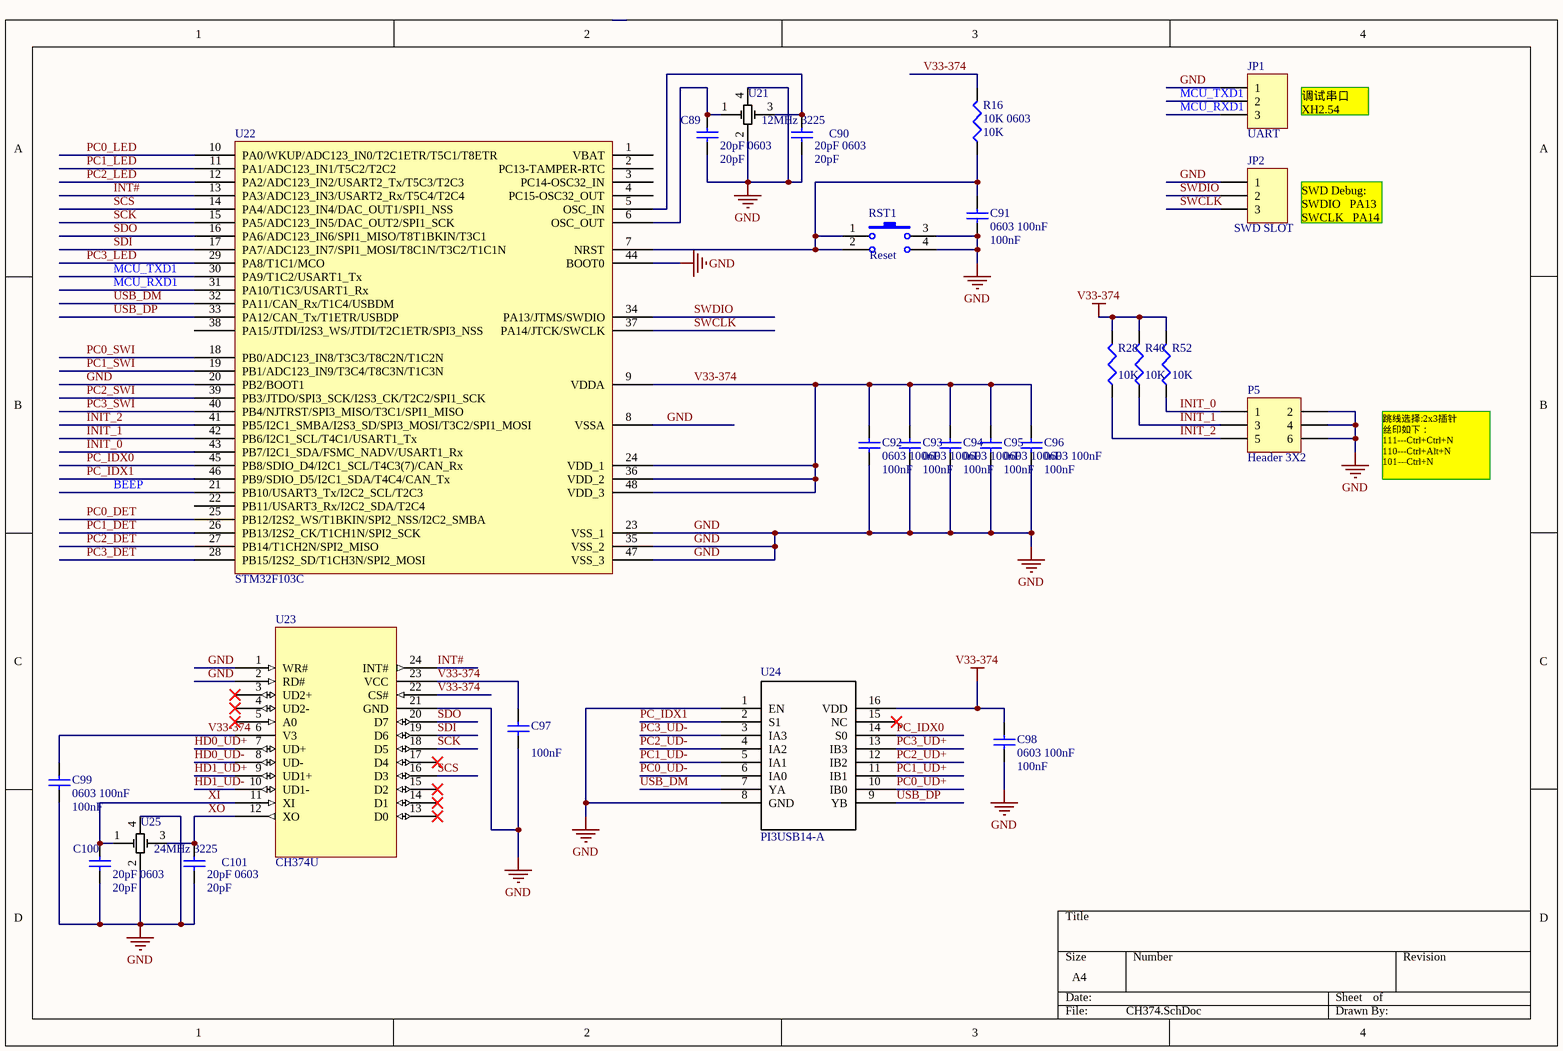
[diagram p7: CH374.SchDoc]

### Parts
C89  20pF 0603  value 20pF  [C0603]
C90  20pF 0603  value 20pF  [C0603]
C91  0603 100nF  value 100nF  [C0603]
C92  0603 100nF  value 100nF  [C0603]
C93  0603 100nF  value 100nF  [C0603]
C94  0603 100nF  value 100nF  [C0603]
C95  0603 100nF  value 100nF  [C0603]
C96  0603 100nF  value 100nF  [C0603]
C97  value 100nF  [C0603]  (hidden comment: 0603 100nF)
C98  0603 100nF  value 100nF  [C0603]
C99  0603 100nF  value 100nF  [C0603]
C100  20pF 0603  value 20pF  [C0603]
C101  20pF 0603  value 20pF  [C0603]
JP1  UART  [XH25-3]
JP2  SWD SLOT  [HDR1X3DIP100A]
P5  Header 3X2  [HDR2X3]
R16  10K 0603  value 10K  [R0603]
R28  value 10K  [R0603]  (hidden comment: 10K 0603)
R40  value 10K  [R0603]  (hidden comment: 10K 0603)
R52  value 10K  [R0603]  (hidden comment: 10K 0603)
RST1  Reset  [key_4SMD7351]
U21  12MHz 3225  [XTAL-3225]
U22  STM32F103C  [QFP48-20-0909B]
U23  CH374U  [SSOP24]
U24  PI3USB14-A  [sop16-26-064a]
U25  24MHz 3225  [XTAL-3225]

### Nets
GND: C89.1 C90.1 C91.1 C92.1 C93.1 C94.1 C95.1 C96.1 C97.1 C98.1 C99.1 C100.1 C101.1 JP1.1 JP2.1 P5.2 P5.4 P5.6 RST1.3 RST1.4 U21.2 U21.4 U22.8(VSSA) U22.20(PB2/BOOT1) U22.23(VSS_1) U22.35(VSS_2) U22.44(BOOT0) U22.47(VSS_3) U23.1(WR#) U23.2(RD#) U23.21(GND) U24.1(EN) U24.8(GND) U25.2 U25.4
V33-374: C92.2 C93.2 C94.2 C95.2 C96.2 C97.2 C98.2 C99.2 R16.2 R28.2 R40.2 R52.2 U22.9(VDDA) U22.24(VDD_1) U22.36(VDD_2) U22.48(VDD_3) U23.6(V3) U23.22(CS#) U23.23(VCC) U24.16(VDD)
BEEP: U22.21(PB10/USART3_Tx/I2C2_SCL/T2C3)
HD0_UD+: U23.7(UD+)
HD0_UD-: U23.8(UD-)
HD1_UD+: U23.9(UD1+)
HD1_UD-: U23.10(UD1-)
INIT_0: P5.1 R52.1 U22.43(PB7/I2C1_SDA/FSMC_NADV/USART1_Rx)
INIT_1: P5.3 R40.1 U22.42(PB6/I2C1_SCL/T4C1/USART1_Tx)
INIT_2: P5.5 R28.1 U22.41(PB5/I2C1_SMBA/I2S3_SD/SPI3_MOSI/T3C2/SPI1_MOSI)
INT#: U22.13(PA3/ADC123_IN3/USART2_Rx/T5C4/T2C4) U23.24(INT#)
MCU_RXD1: JP1.3 U22.31(PA10/T1C3/USART1_Rx)
MCU_TXD1: JP1.2 U22.30(PA9/T1C2/USART1_Tx)
PC0_DET: U22.25(PB12/I2S2_WS/T1BKIN/SPI2_NSS/I2C2_SMBA)
PC0_LED: U22.10(PA0/WKUP/ADC123_IN0/T2C1ETR/T5C1/T8ETR)
PC0_SWI: U22.18(PB0/ADC123_IN8/T3C3/T8C2N/T1C2N)
PC0_UD+: U24.10(IB0)
PC0_UD-: U24.6(IA0)
PC1_DET: U22.26(PB13/I2S2_CK/T1CH1N/SPI2_SCK)
PC1_LED: U22.11(PA1/ADC123_IN1/T5C2/T2C2)
PC1_SWI: U22.19(PB1/ADC123_IN9/T3C4/T8C3N/T1C3N)
PC1_UD+: U24.11(IB1)
PC1_UD-: U24.5(IA1)
PC2_DET: U22.27(PB14/T1CH2N/SPI2_MISO)
PC2_LED: U22.12(PA2/ADC123_IN2/USART2_Tx/T5C3/T2C3)
PC2_SWI: U22.39(PB3/JTDO/SPI3_SCK/I2S3_CK/T2C2/SPI1_SCK)
PC2_UD+: U24.12(IB2)
PC2_UD-: U24.4(IA2)
PC3_DET: U22.28(PB15/I2S2_SD/T1CH3N/SPI2_MOSI)
PC3_LED: U22.29(PA8/T1C1/MCO)
PC3_SWI: U22.40(PB4/NJTRST/SPI3_MISO/T3C1/SPI1_MISO)
PC3_UD+: U24.13(IB3)
PC3_UD-: U24.3(IA3)
PC_IDX0: U22.45(PB8/SDIO_D4/I2C1_SCL/T4C3(7)/CAN_Rx) U24.14(S0)
PC_IDX1: U22.46(PB9/SDIO_D5/I2C1_SDA/T4C4/CAN_Tx) U24.2(S1)
SCK: U22.15(PA5/ADC123_IN5/DAC_OUT2/SPI1_SCK) U23.18(D5)
SCS: U22.14(PA4/ADC123_IN4/DAC_OUT1/SPI1_NSS) U23.16(D3)
SDI: U22.17(PA7/ADC123_IN7/SPI1_MOSI/T8C1N/T3C2/T1C1N) U23.19(D6)
SDO: U22.16(PA6/ADC123_IN6/SPI1_MISO/T8T1BKIN/T3C1) U23.20(D7)
SWCLK: JP2.3 U22.37(PA14/JTCK/SWCLK)
SWDIO: JP2.2 U22.34(PA13/JTMS/SWDIO)
USB_DM: U22.32(PA11/CAN_Rx/T1C4/USBDM) U24.7(YA)
USB_DP: U22.33(PA12/CAN_Tx/T1ETR/USBDP) U24.9(YB)
XI: C100.2 U23.11(XI) U25.1
XO: C101.2 U23.12(XO) U25.3
NetC89_2: C89.2 U21.1 U22.6(OSC_OUT)
NetC90_2: C90.2 U21.3 U22.5(OSC_IN)
NetC91_2: C91.2 R16.1 RST1.1 RST1.2 U22.7(NRST)

Not connected (* = marked no-connect by the designer): U22 1(VBAT) 2(PC13-TAMPER-RTC) 3(PC14-OSC32_IN) 4(PC15-OSC32_OUT) 22(PB11/USART3_Rx/I2C2_SDA/T2C4) 38(PA15/JTDI/I2S3_WS/JTDI/T2C1ETR/SPI3_NSS); U23 3(UD2+)* 4(UD2-)* 5(A0)* 13(D0)* 14(D1)* 15(D2)* 17(D4)*; U24 15(NC)*

### Notes on the sheet
- 调试串口
  XH2.54
- SWD Debug:
  SWDIO   PA13
  SWCLK   PA14
- 跳线选择:2x3插针
  丝印如下：
  111---Ctrl+Ctrl+N
  110---Ctrl+Alt+N
  101---Ctrl+N

### Library data of the parts
C89-C101 = Cap Semi: Capacitor (Semiconductor SIM Model); Published: 8-Jun-2000; LatestRevisionDate: 29-May-2009; LatestRevisionNote: IPC-7351 Footprint Added.; PackageReference: C1206; Publisher: Altium Limited; PackageDescription: Chip Capacitor
JP1 JP2 = Header 3: Header, 3-Pin; LatestRevisionDate: 17-Jul-2002; LatestRevisionNote: Re-released for DXP Platform.; Publisher: Altium Limited
P5 = Header 3X2: Header, 3-Pin, Dual row; LatestRevisionDate: 17-Jul-2002; LatestRevisionNote: Re-released for DXP Platform.; Publisher: Altium Limited
R16 R28 R40 R52 = Res3: Resistor; Published: 8-Jun-2000; LatestRevisionDate: 29-May-2009; LatestRevisionNote: IPC-7351 Footprint Added.; PackageReference: J1-0603; Publisher: Altium Limited; PackageDescription: Chip Resistor
RST1 = key_4smd7337: value: button_4smt
U21 U25 = Component_1
U22 = STM32F103C: STM32单片机48引脚
U24 = PI3USB14-A: Imported; Designer: Chiphome; Device: PI3USB14-A; RefDes: RefDes; Type: DEV; Value: Value

## Nets that join several sheets
GND: CH9374 (5 pins), GL852-0 (28 pins), GL852-1 (28 pins), GL852-2 (28 pins), GL852-3 (28 pins), USB-Switch (47 pins), Audio (66 pins), CH374 (35 pins)
V5: CH9374 (B1.1 C88.2 D34.3), GL852-0 (C18.2 C86.2 D39.3 R29.2), GL852-1 (C32.2 C87.2 D46.3 R41.2), GL852-2 (C46.2 C84.2 D53.3 R53.2), GL852-3 (C60.2 C85.2 D60.3 R65.2), USB-Switch (12 pins), Audio (C9.2 C10.2 U3.16 U4.16)
V33-374: CH9374 (C11.2 D34.2 D34.4 D35.1), USB-Switch (C82.2 C83.2 U19.16 U20.16), CH374 (20 pins)
AUDIO-SEL0: USB-Switch (P3.18), Audio (U3.10 U4.10)
AUDIO-SEL1: USB-Switch (P3.19), Audio (U3.9 U4.9)
BEEP: CH9374 (R18.1), CH374 (U22.21)
GL0-DM2: GL852-0 (U9.9), USB-Switch (U19.10)
GL0-DM3: GL852-0 (U9.17), USB-Switch (U20.10)
GL0-DP2: GL852-0 (U9.10), USB-Switch (U19.6)
GL0-DP3: GL852-0 (U9.18), USB-Switch (U20.6)
GL0-RESET: GL852-0 (C31.2 R36.2 U9.26), USB-Switch (P3.7)
GL0-UD+: GL852-0 (U9.4), Audio (D23.2 U1.3)
GL0-UD-: GL852-0 (U9.3), Audio (D22.2 U1.2)
GL1-DM2: GL852-1 (U11.9), USB-Switch (U19.11)
GL1-DM3: GL852-1 (U11.17), USB-Switch (U20.11)
GL1-DP2: GL852-1 (U11.10), USB-Switch (U19.5)
GL1-DP3: GL852-1 (U11.18), USB-Switch (U20.5)
GL1-RESET: GL852-1 (C45.2 R48.2 U11.26), USB-Switch (P3.8)
GL1-UD+: GL852-1 (U11.4), Audio (D29.2 U5.3)
GL1-UD-: GL852-1 (U11.3), Audio (D28.2 U5.2)
GL2-DM2: GL852-2 (U13.9), USB-Switch (U19.12)
GL2-DM3: GL852-2 (U13.17), USB-Switch (U20.12)
GL2-DP2: GL852-2 (U13.10), USB-Switch (U19.4)
GL2-DP3: GL852-2 (U13.18), USB-Switch (U20.4)
GL2-RESET: GL852-2 (C59.2 R60.2 U13.26), USB-Switch (P3.9)
GL2-UD+: GL852-2 (U13.4), Audio (D26.2 U2.3)
GL2-UD-: GL852-2 (U13.3), Audio (D25.2 U2.2)
GL3-DM2: GL852-3 (U15.9), USB-Switch (U19.13)
GL3-DM3: GL852-3 (U15.17), USB-Switch (U20.13)
GL3-DP2: GL852-3 (U15.10), USB-Switch (U19.3)
GL3-DP3: GL852-3 (U15.18), USB-Switch (U20.3)
GL3-RESET: GL852-3 (C73.2 R72.2 U15.26), USB-Switch (P3.10)
GL3-UD+: GL852-3 (U15.4), Audio (D32.2 U6.3)
GL3-UD-: GL852-3 (U15.3), Audio (D31.2 U6.2)
HD0_UD+: USB-Switch (D69.2 J11.A3), CH374 (U23.7)
HD0_UD-: USB-Switch (D68.2 J11.A2), CH374 (U23.8)
HD1_UD+: USB-Switch (D71.2 J11.B3), CH374 (U23.9)
HD1_UD-: USB-Switch (D70.2 J11.B2), CH374 (U23.10)
OVCUR1: GL852-0 (U9.42), GL852-1 (U11.42), GL852-2 (U13.42), GL852-3 (U15.42), USB-Switch (R79.1 R80.1)
PC0_ABS_LED: USB-Switch (P4.7), Audio (R1.2)
PC0_DET: Audio (R3.1 R5.2), CH374 (U22.25)
PC0_LED: CH9374 (R15.1), CH374 (U22.10)
PC0_ON_LED: CH9374 (R15.2), USB-Switch (P4.3)
PC0_SWI: USB-Switch (P4.11), CH374 (U22.18)
PC0_UD+: GL852-0 (U9.6), CH374 (U24.10)
PC0_UD-: GL852-0 (U9.5), CH374 (U24.6)
PC1_ABS_LED: USB-Switch (P4.8), Audio (R7.2)
PC1_DET: Audio (R9.1 R11.2), CH374 (U22.26)
PC1_LED: CH9374 (R17.1), CH374 (U22.11)
PC1_ON_LED: CH9374 (R17.2), USB-Switch (P4.4)
PC1_SWI: USB-Switch (P4.12), CH374 (U22.19)
PC1_UD+: GL852-1 (U11.6), CH374 (U24.11)
PC1_UD-: GL852-1 (U11.5), CH374 (U24.5)
PC2_ABS_LED: USB-Switch (P4.9), Audio (R2.2)
PC2_DET: Audio (R4.1 R6.2), CH374 (U22.27)
PC2_LED: CH9374 (R19.1), CH374 (U22.12)
PC2_ON_LED: CH9374 (R19.2), USB-Switch (P4.5)
PC2_SWI: USB-Switch (P4.13), CH374 (U22.39)
PC2_UD+: GL852-2 (U13.6), CH374 (U24.12)
PC2_UD-: GL852-2 (U13.5), CH374 (U24.4)
PC3_ABS_LED: USB-Switch (P4.10), Audio (R8.2)
PC3_DET: Audio (R10.1 R12.2), CH374 (U22.28)
PC3_LED: CH9374 (R21.1), CH374 (U22.29)
PC3_ON_LED: CH9374 (R21.2), USB-Switch (P4.6)
PC3_SWI: USB-Switch (P4.14), CH374 (U22.40)
PC3_UD+: GL852-3 (U15.6), CH374 (U24.13)
PC3_UD-: GL852-3 (U15.5), CH374 (U24.3)
PC_IDX0: USB-Switch (P3.11), CH374 (U22.45 U24.14)
PC_IDX1: USB-Switch (P3.12), CH374 (U22.46 U24.2)